# Altium schematic sheet Versterker.SchDoc: Soldeerstation
size A4; DrawnBy: Miguel Nunez; DocumentNumber: 2022/001; Revision: v1; SheetNumber: 3; SheetTotal: 6
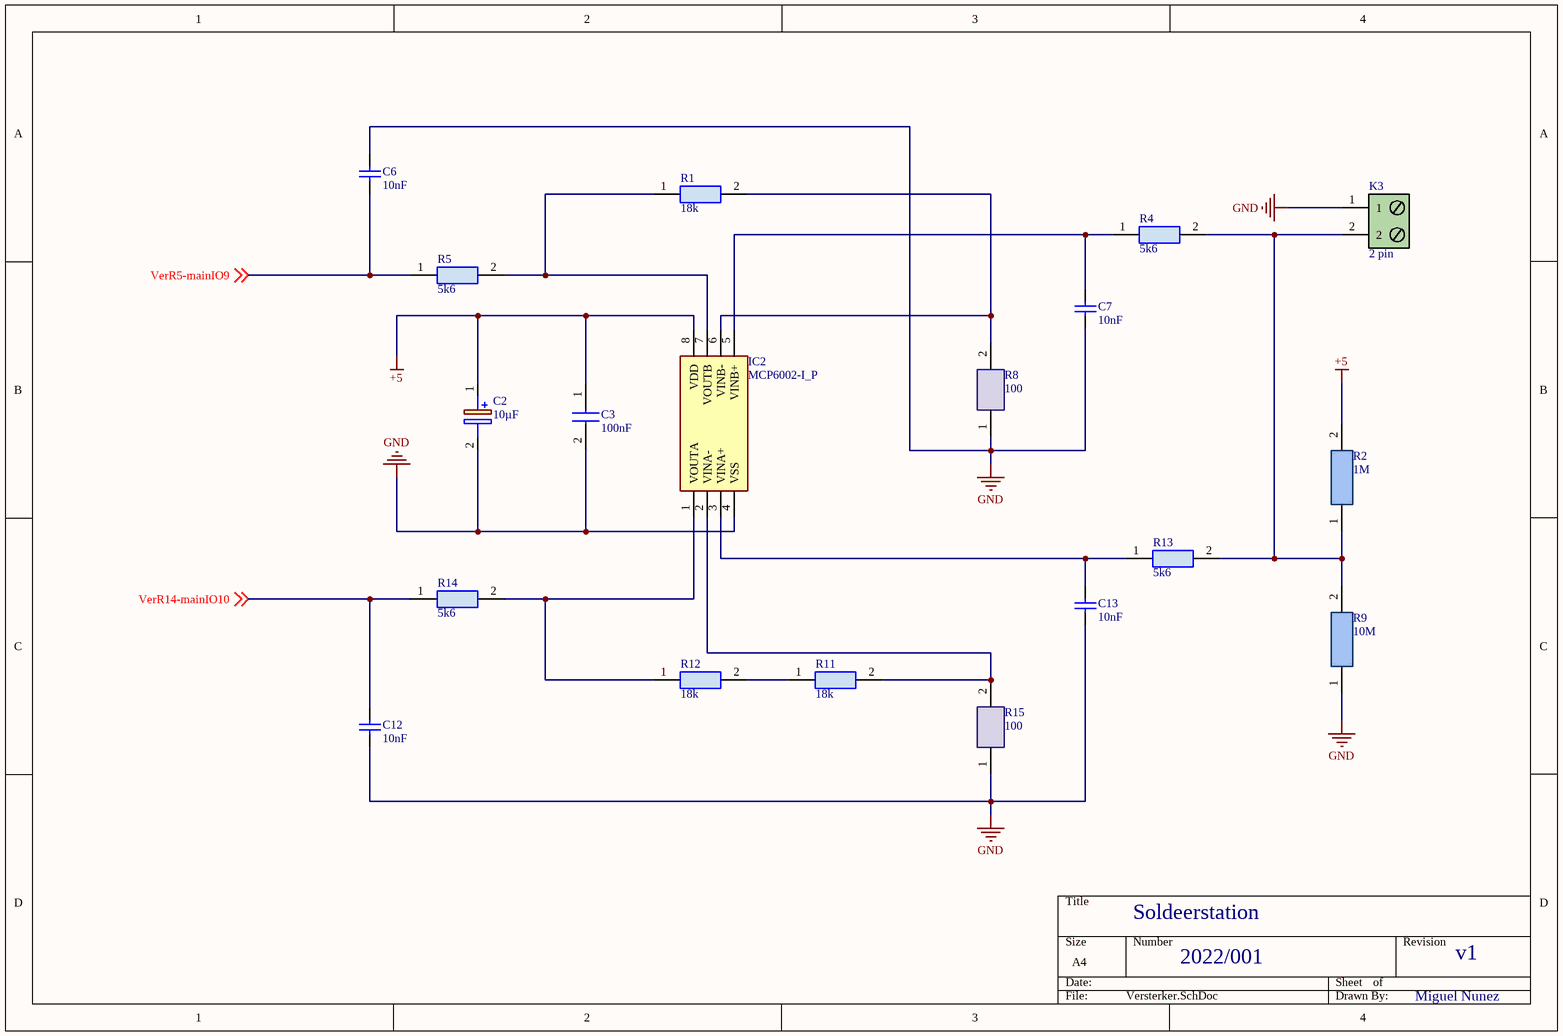
[diagram p0: Versterker.SchDoc]

## Parts
C2  10µF  [WCAP-AT1H_D5H11]
C3  100nF  [WCAP-CSGP_0805_L2W1.25H0.8_Reflow]
C6  10nF  [WCAP-CSGP_0805_L2W1.25H0.8_Reflow]
C7  10nF  [WCAP-CSGP_0805_L2W1.25H0.8_Reflow]
C12  10nF  [WCAP-CSGP_0805_L2W1.25H0.8_Reflow]
C13  10nF  [WCAP-CSGP_0805_L2W1.25H0.8_Reflow]
IC2  MCP6002-I_P  [DIP781W56P254L950H533Q8N]
K3  2 pin  [1729128]
R1  18k  [RESC2012X60N]
R2  1M  [RESC3115X65N]
R4  5k6  [RESC2012X50N]
R5  5k6  [RESC2012X50N]
R8  100  [RESC1220X65N]
R9  10M  [RESC3115X65N]
R11  18k  [RESC2012X60N]
R12  18k  [RESC2012X60N]
R13  5k6  [RESC2012X50N]
R14  5k6  [RESC2012X50N]
R15  100  [RESC1220X65N]

## Nets
+5: C2.1(+) C3.1 IC2.8(VDD) R2.2
GND: C2.2(-) C3.2 C6.2 C7.1 C12.1 C13.1 IC2.4(VSS) K3.1 R8.1 R9.1 R15.1
VerR5-mainIO9: C6.1 R5.1 ; off-sheet VerR5-mainIO9
VerR14-mainIO10: C12.2 R14.1 ; off-sheet VerR14-mainIO10
NetC7_2: C7.2 IC2.5(VINB+) R4.1
NetC13_2: C13.2 IC2.3(VINA+) R13.1
NetIC2_1: IC2.1(VOUTA) R12.1 R14.2
NetIC2_2: IC2.2(VINA-) R11.2 R15.2
NetIC2_6: IC2.6(VINB-) R1.2 R8.2
NetIC2_7: IC2.7(VOUTB) R1.1 R5.2
NetK3_2: K3.2 R2.1 R4.2 R9.2 R13.2
NetR11_1: R11.1 R12.2

## Library data of the parts
C2 = ELCAP 10µF: Capacitor Polarised Wurth Elektronik 860240672002 10µF; Datasheet Link: https://katalog.we-online.de/pbs/datasheet/860240672002.pdf; Height: 12.5mm; Manufacturer_Name: Wurth Elektronik; Manufacturer_Part_Number: 860240672002
C3 = CAP 0.1µF (100nF): Capacitor C0805C104K8RACAUTO; Manufacturer_Name: Kemet; Datasheet Link: https://ad.componentsearchengine.com/Datasheets/2/C0805C104K8RACAUTO.pdf; Height: 0.88mm; Manufacturer_Part_Number: C0805C104K8RACAUTO
C6 C7 C12 C13 = CAP 0.01µF WE: WCAP-CSGP Multilayer Ceramic Chip Capacitor, General Purpose, size 0805, X7R, 10nF, 50V  885012207092; Manufacturer: Wurth Elektronik; Capacitance Tolerance: +/-10%; Dissipation Factor: 2.5%; Isolation Resistance: 10GOhm; Technical Reference: X7R0805103K050DFCT10000; Capacitance: 10nF; Ceramic Type: X7R; ComponentLink1Description: Manufacturer Link; ComponentLink1URL: http://www.we-online.de; ComponentLink2Description: Datasheet; ComponentLink2URL: https://www.we-online.com/catalog/datasheet/885012207092.pdf; Height: 0.8mm; Length: 2mm; Manufacturer Part Number: 885012207092; Mounting Technology: SMT; Operating Temperature max.: 125C; Operating Temperature min.: -55C; Packaging: Tape and Reel; Rated Voltage: 50V; Size: 0805; Width: 1.25mm
IC2 = MCP6002-I_P: Integrated Circuit Dual OPAMP MCP6002-I/P; Manufacturer_Name: Microchip; Datasheet Link: https://componentsearchengine.com//MCP6002-I_P.pdf; Height: 5.334mm; Mouser2 Part Number: 579-MCP6002-I/P; Mouser2 Price/Stock: https://www.mouser.com/Search/Refine.aspx?Keyword=579-MCP6002-I%2FP; Manufacturer_Part_Number: MCP6002-I/P
K3 = Term. blok 2 pin: Connector Term. blok. 1729128 2 pin; Manufacturer_Name: Phoenix Contact; Datasheet Link: http://www.phoenixcontact.com/de/produkte/1729128/pdf; Height: 10.15mm; Manufacturer_Part_Number: 1729128
R1 R11 R12 = RES 18k 0805: 18kΩ ±0.5% 0.1W 1/10W Chip Resistor 0805 (2012 Metric) Thin Film  RR1220P-183-D; Voltage Rating: 100V; Temperature Coefficient: 25ppm/°C; Power Rating: 100mW; Resistance: 18kR; Length: 2mm; Lead Free: Lead Free; Height: 0.4mm; Depth: 1.25mm; Packaging: Tape and Reel; Min Operating Temperature: -55°C; Case Code (Metric): 2012; Termination: SMD/SMT; Voltage Rating (DC): 100V; Case/Package: 0805; Max Operating Temperature: 125°C; RoHS Compliant: Yes; Mount: Surface Mount; Case Code (Imperial): 0805; Technology: THIN FILM; Tolerance: 0.5%; Number of Terminations: 2; Max Power Dissipation: 100mW; Series: RR; Size Code: 0805
R2 = RES 1M 1206: Res Thin Film 1206 1M0Ω 0.1% 0.25W 15ppm/°C Molded SMD; Manufacturer: TE Connectivity; Manufacturer Part Number: RP73D2B1M0BTDF; Voltage Rating: 200V; Temperature: -55°C to 155°C; Device Class L2: Resistors; Resistance: 1M0Ω; octopart_url: https://octopart.com/rp73d2b1m0btdf-te+connectivity-22741454; Power Rating: 0.25W; Temperature Range High: 155°C; ComponentLink2Description: Datasheet; Category: Res; Octopart: https://octopart.com/rp73d2b1m0btdf-te+connectivity-22741454; ComponentLink2URL: https://www.te.com/commerce/DocumentDelivery/DDEController?Action=showdoc&DocId=Data+Sheet%7F1773272%7FL%7Fpdf%7FEnglish%7FENG_DS_1773272_L.pdf%7F8-1879255-6; Package: RP732B; packaging: 1000 Reel; Ipc Land Pattern Name: RESC305155X55; Tolerance: 0.1%; Device Class L1: Passive Components; Series: RP73; Height: 0.65mm; Lead Free: Yes; Value: 1M0Ω; Device Class L3: Chip SMD Resistors; Temperature Coefficient: 15ppm/°C; Automotive: No; Composition: Thin Film; Temperature Range Low: -55°C; RoHS: TRUE
R4 R5 R13 R14 = RES 5k6 0805: 5k6 SMD 0805  CRCW08055K60JNEA; Manufacturer_Name: Vishay; Datasheet Link: http://www.vishay.com/docs/20035/dcrcwe3.pdf; Height: 0.5mm; Manufacturer_Part_Number: CRCW08055K60JNEA
R8 R15 = RES 100 0508: 100 Ohm SMD 0508  LTR10EZPJ101; Manufacturer_Name: ROHM Semiconductor; Datasheet Link: https://componentsearchengine.com//LTR10EZPJ101.pdf; Height: 0.65mm; Mouser2 Part Number: 755-LTR10EZPJ101; Mouser2 Price/Stock: https://www.mouser.com/Search/Refine.aspx?Keyword=755-LTR10EZPJ101; Manufacturer_Part_Number: LTR10EZPJ101
R9 = RES 10M 1206: Res Thin Film 1206 1M0Ω 0.1% 0.25W 15ppm/°C Molded SMD  1206 10M 5% 0.25W TCR200; Manufacturer: TE Connectivity; Manufacturer Part Number: RP73D2B1M0BTDF; Voltage Rating: 200V; Temperature: -55°C to 155°C; Device Class L2: Resistors; Resistance: 1M0Ω; octopart_url: https://octopart.com/rp73d2b1m0btdf-te+connectivity-22741454; Power Rating: 0.25W; Temperature Range High: 155°C; ComponentLink2Description: Datasheet; Category: Res; Octopart: https://octopart.com/rp73d2b1m0btdf-te+connectivity-22741454; ComponentLink2URL: https://www.te.com/commerce/DocumentDelivery/DDEController?Action=showdoc&DocId=Data+Sheet%7F1773272%7FL%7Fpdf%7FEnglish%7FENG_DS_1773272_L.pdf%7F8-1879255-6; Package: RP732B; packaging: 1000 Reel; Ipc Land Pattern Name: RESC305155X55; Tolerance: 0.1%; Device Class L1: Passive Components; Series: RP73; Height: 0.65mm; Lead Free: Yes; Value: 1M0Ω; Device Class L3: Chip SMD Resistors; Temperature Coefficient: 15ppm/°C; Automotive: No; Composition: Thin Film; Temperature Range Low: -55°C; RoHS: TRUE